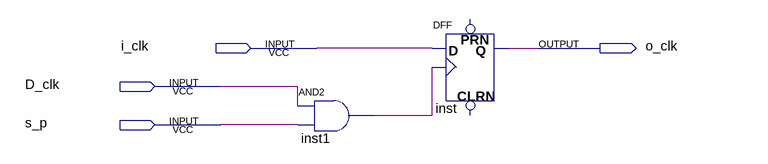
[diagram p0: schematic sheet]
// Quartus schematic start_pause.bdf as structural Verilog: 2 symbols, 4 pins
module start_pause (
  input  i_clk,
  input  D_clk,
  input  s_p,
  output o_clk
);

  wire inst1_out;

  and inst1 (inst1_out, D_clk, s_p);
  DFF inst (.CLK(inst1_out), .D(i_clk), .Q(o_clk));  // open: CLRN, PRN
endmodule
